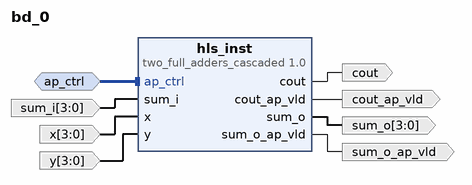
[diagram p0: block diagram of the top level]
# Vivado block design bd_0, xcvu11p-flga2577-1-e, Vivado 2023.2
create_bd_design bd_0

create_bd_intf_port -mode Slave -vlnv xilinx.com:interface:acc_handshake_rtl:1.0 ap_ctrl
create_bd_port -dir O -type data cout
create_bd_port -dir O cout_ap_vld
create_bd_port -dir I -from 3 -to 0 -type data sum_i
create_bd_port -dir O -from 3 -to 0 -type data sum_o
create_bd_port -dir O sum_o_ap_vld
create_bd_port -dir I -from 3 -to 0 -type data x
create_bd_port -dir I -from 3 -to 0 -type data y

create_bd_cell -type ip -vlnv xilinx.com:hls:two_full_adders_cascaded:1.0 hls_inst

# ---- connections ----

connect_bd_intf_net -intf_net ap_ctrl_0_1 [get_bd_intf_ports ap_ctrl] [get_bd_intf_pins hls_inst/ap_ctrl]
connect_bd_net [get_bd_pins hls_inst/cout] [get_bd_ports cout]
connect_bd_net [get_bd_pins hls_inst/cout_ap_vld] [get_bd_ports cout_ap_vld]
connect_bd_net [get_bd_pins hls_inst/sum_o] [get_bd_ports sum_o]
connect_bd_net [get_bd_pins hls_inst/sum_o_ap_vld] [get_bd_ports sum_o_ap_vld]
connect_bd_net -net sum_i_0_1 [get_bd_ports sum_i] [get_bd_pins hls_inst/sum_i]
connect_bd_net -net x_0_1 [get_bd_ports x] [get_bd_pins hls_inst/x]
connect_bd_net -net y_0_1 [get_bd_ports y] [get_bd_pins hls_inst/y]

validate_bd_design
save_bd_design
